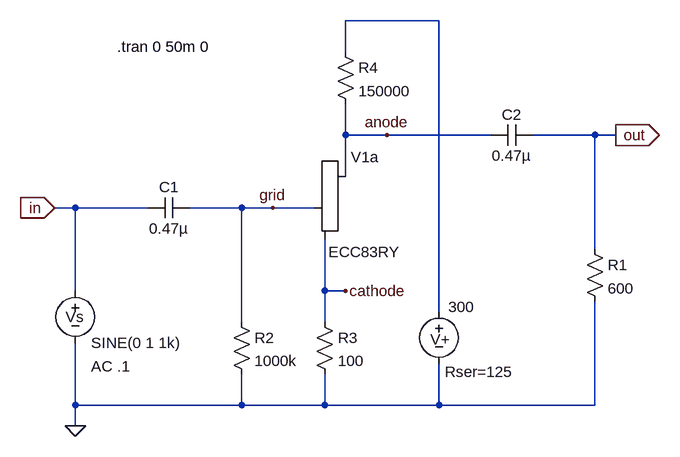
[diagram p0: schematic ecc83_test1.asc]
ecc83_test1.asc, the LTspice schematic file:
Version 4
SHEET 1 1104 896
WIRE 512 -96 368 -96
WIRE 368 -48 368 -96
WIRE 368 80 368 32
WIRE 432 80 368 80
WIRE 592 80 432 80
WIRE 752 80 656 80
WIRE 784 80 752 80
WIRE 368 144 368 80
WIRE -48 192 -80 192
WIRE 64 192 -48 192
WIRE 208 192 128 192
WIRE 256 192 208 192
WIRE 320 192 256 192
WIRE 752 256 752 80
WIRE -48 320 -48 192
WIRE 336 320 336 240
WIRE 368 320 336 320
WIRE 512 352 512 -96
WIRE 208 368 208 192
WIRE 336 368 336 320
WIRE -48 496 -48 400
WIRE 208 496 208 448
WIRE 208 496 -48 496
WIRE 336 496 336 448
WIRE 336 496 208 496
WIRE 512 496 512 432
WIRE 512 496 336 496
WIRE 752 496 752 336
WIRE 752 496 512 496
WIRE -48 528 -48 496
FLAG -48 528 0
FLAG 432 80 anode
FLAG 784 80 out
IOPIN 784 80 Out
FLAG -80 192 in
IOPIN -80 192 In
FLAG 368 320 cathode
FLAG 256 192 grid
SYMBOL voltage -48 304 R0
WINDOW 123 24 132 Left 0
WINDOW 39 0 0 Left 0
WINDOW 0 -15 56 Left 0
SYMATTR Value2 AC .1
SYMATTR InstName Vs
SYMATTR Value SINE(0 1 1k)
SYMBOL voltage 512 336 R0
WINDOW 123 0 0 Left 0
WINDOW 39 9 109 Left 0
WINDOW 0 -13 59 Left 0
WINDOW 3 14 9 Left 0
SYMATTR SpiceLine Rser=125
SYMATTR InstName V+
SYMATTR Value 300
SYMBOL cap 128 176 R90
WINDOW 0 0 32 VBottom 0
WINDOW 3 32 32 VTop 0
SYMATTR InstName C1
SYMATTR Value 0.47µ
SYMBOL cap 656 64 R90
WINDOW 0 0 32 VBottom 0
WINDOW 3 32 32 VTop 0
SYMATTR InstName C2
SYMATTR Value 0.47µ
SYMBOL res 736 240 R0
SYMATTR InstName R1
SYMATTR Value 600
SYMBOL res 192 352 R0
SYMATTR InstName R2
SYMATTR Value 1000k
SYMBOL res 352 -64 R0
SYMATTR InstName R4
SYMATTR Value 150000
SYMATTR SpiceLine tol=1 pwr=10
SYMBOL res 320 352 R0
SYMATTR InstName R3
SYMATTR Value 100
SYMBOL Valve\\triode 368 192 R0
WINDOW 38 29 68 Center 0
SYMATTR SpiceModel ECC83RY
SYMATTR InstName V1a
TEXT 16 -56 Left 0 !.tran 0 50m 0

The netlist it stands for:
* ecc83_test1.asc
Vs in 0 SINE(0 1 1k) AC .1
V+ N001 0 300 Rser=125
C1 grid in 0.47µ
C2 out anode 0.47µ
R1 out 0 600
R2 grid 0 1000k
R4 N001 anode 150000 tol=1 pwr=10
R3 cathode 0 100
XV1a anode grid cathode ECC83RY
.tran 0 50m 0
.backanno
.end